# Altium schematic sheet Sheet1.SchDoc
size A4
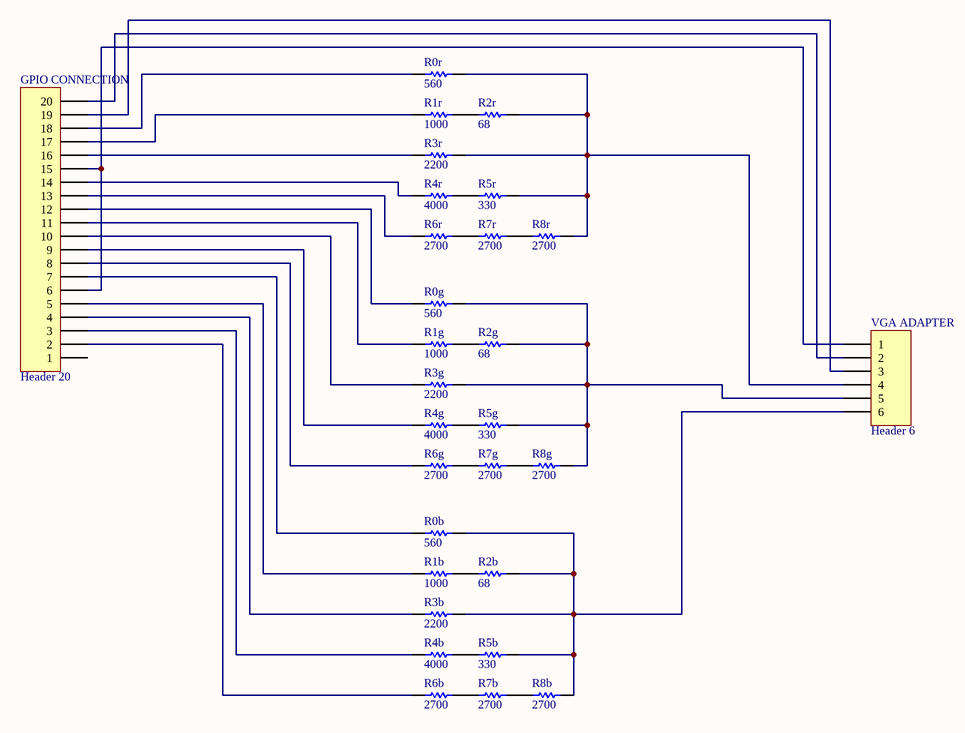
[diagram p0: Sheet1.SchDoc]

## Parts
GPIO_CONNECTION  Header 20  [HDR1X20]
R0b  560  [RES400]
R0g  560  [RES400]
R0r  560  [RES400]
R1b  1000  [RES400]
R1g  1000  [RES400]
R1r  1000  [RES400]
R2b  68  [RES400]
R2g  68  [RES400]
R2r  68  [RES400]
R3b  2200  [RES400]
R3g  2200  [RES400]
R3r  2200  [RES400]
R4b  4000  [RES400]
R4g  4000  [RES400]
R4r  4000  [RES400]
R5b  330  [RES400]
R5g  330  [RES400]
R5r  330  [RES400]
R6b  2700  [RES400]
R6g  2700  [RES400]
R6r  2700  [RES400]
R7b  2700  [RES400]
R7g  2700  [RES400]
R7r  2700  [RES400]
R8b  2700  [RES400]
R8g  2700  [RES400]
R8r  2700  [RES400]
VGA_ADAPTER  Header 6  [HDR1X6]

## Nets
NetGPIO_CONNECTION_2: GPIO_CONNECTION.2 R6b.1
NetGPIO_CONNECTION_3: GPIO_CONNECTION.3 R4b.1
NetGPIO_CONNECTION_4: GPIO_CONNECTION.4 R3b.1
NetGPIO_CONNECTION_5: GPIO_CONNECTION.5 R1b.1
NetGPIO_CONNECTION_6: GPIO_CONNECTION.6 GPIO_CONNECTION.15 VGA_ADAPTER.1
NetGPIO_CONNECTION_7: GPIO_CONNECTION.7 R0b.1
NetGPIO_CONNECTION_8: GPIO_CONNECTION.8 R6g.1
NetGPIO_CONNECTION_9: GPIO_CONNECTION.9 R4g.1
NetGPIO_CONNECTION_10: GPIO_CONNECTION.10 R3g.1
NetGPIO_CONNECTION_11: GPIO_CONNECTION.11 R1g.1
NetGPIO_CONNECTION_12: GPIO_CONNECTION.12 R0g.1
NetGPIO_CONNECTION_13: GPIO_CONNECTION.13 R6r.1
NetGPIO_CONNECTION_14: GPIO_CONNECTION.14 R4r.1
NetGPIO_CONNECTION_16: GPIO_CONNECTION.16 R3r.1
NetGPIO_CONNECTION_17: GPIO_CONNECTION.17 R1r.1
NetGPIO_CONNECTION_18: GPIO_CONNECTION.18 R0r.1
NetGPIO_CONNECTION_19: GPIO_CONNECTION.19 VGA_ADAPTER.3
NetGPIO_CONNECTION_20: GPIO_CONNECTION.20 VGA_ADAPTER.2
NetR0b_2: R0b.2 R2b.2 R3b.2 R5b.2 R8b.2 VGA_ADAPTER.6
NetR0g_2: R0g.2 R2g.2 R3g.2 R5g.2 R8g.2 VGA_ADAPTER.5
NetR0r_2: R0r.2 R2r.2 R3r.2 R5r.2 R8r.2 VGA_ADAPTER.4
NetR1b_2: R1b.2 R2b.1
NetR1g_2: R1g.2 R2g.1
NetR1r_2: R1r.2 R2r.1
NetR4b_2: R4b.2 R5b.1
NetR4g_2: R4g.2 R5g.1
NetR4r_2: R4r.2 R5r.1
NetR6b_2: R6b.2 R7b.1
NetR6g_2: R6g.2 R7g.1
NetR6r_2: R6r.2 R7r.1
NetR7b_2: R7b.2 R8b.1
NetR7g_2: R7g.2 R8g.1
NetR7r_2: R7r.2 R8r.1

Not connected (* = marked no-connect by the designer): GPIO_CONNECTION 1

## Library data of the parts
GPIO_CONNECTION = Header 20: Header, 20-Pin; LatestRevisionDate: 17-Jul-2002; LatestRevisionNote: Re-released for DXP Platform.; Publisher: Altium Limited
R0b R0g R0r R1b R1g R1r R2b R2g R2r R3b R3g R3r R4b R4g R4r R5b R5g R5r R6b R6g R6r R7b R7g R7r R8b R8g R8r = RES
VGA_ADAPTER = Header 6: Header, 6-Pin; LatestRevisionDate: 17-Jul-2002; LatestRevisionNote: Re-released for DXP Platform.; Publisher: Altium Limited